# Altium schematic sheet Boost.SchDoc
size A; SheetNumber: 5; SheetTotal: 17
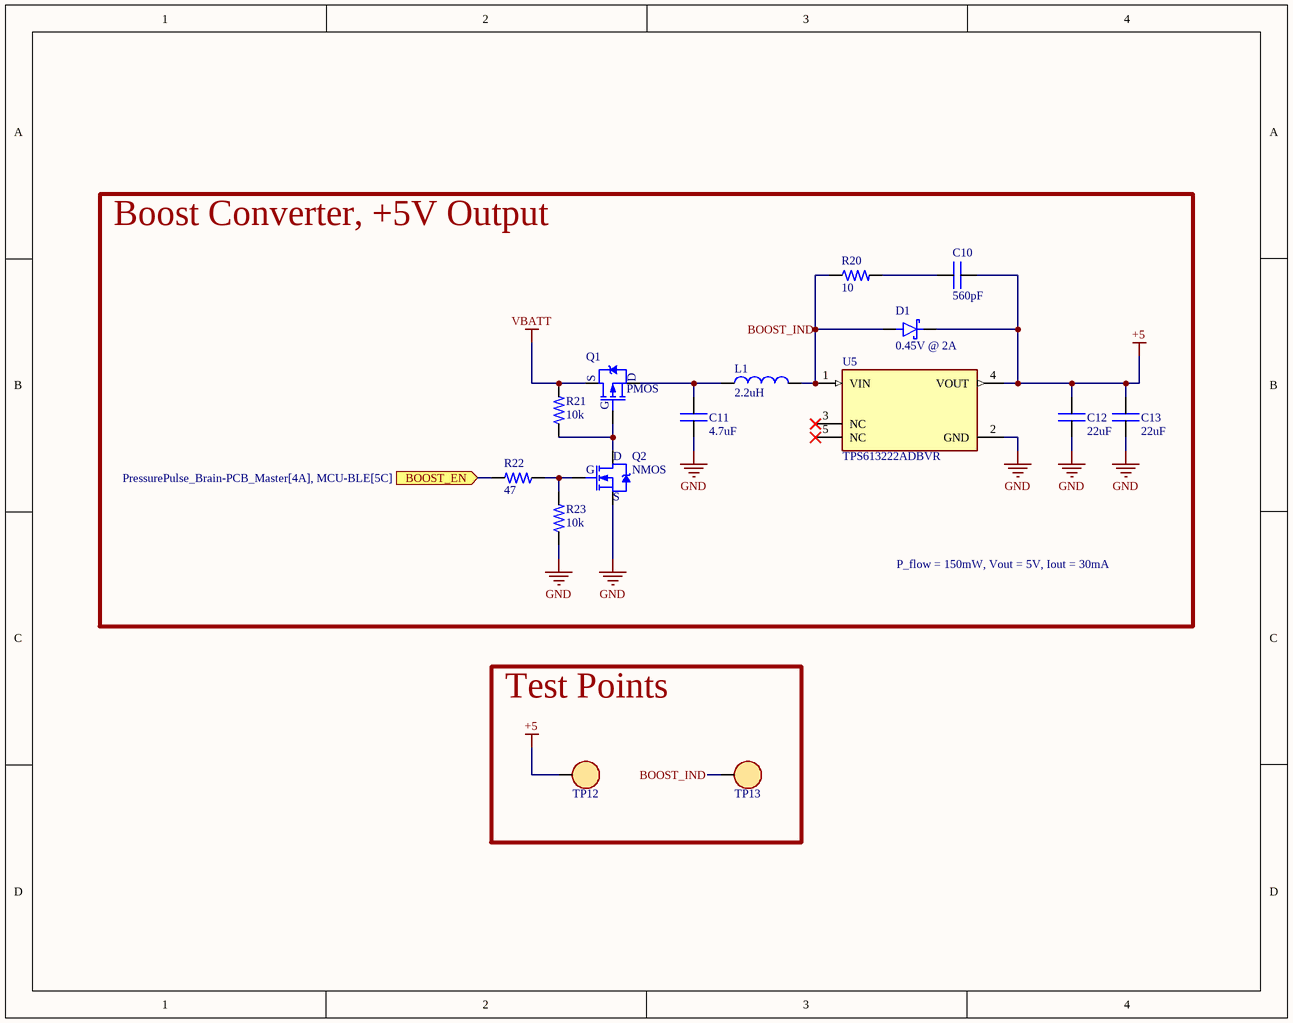
[diagram p0: Boost.SchDoc]

## Parts
C10  value 560pF  [0805C]  (hidden comment: CAP)
C11  value 4.7uF  [0402C]  (hidden comment: CAP)
C12  value 22uF  [0805C]  (hidden comment: CAP)
C13  value 22uF  [0805C]  (hidden comment: CAP)
D1  0.45V @ 2A  [SMAF]
L1  value 2.2uH  [0805L]  (hidden comment: IND)
Q1  PMOS  [SOT-23]
Q2  NMOS  [SOT-23]
R20  value 10  [2512R]  (hidden comment: RES)
R21  value 10k  [0402R]  (hidden comment: RES)
R22  value 47  [0402R]  (hidden comment: RES)
R23  value 10k  [0402R]  (hidden comment: RES)
TP12  RH-5019  [TP - RH-5019]  (value not drawn)
TP13  RH-5019  [TP - RH-5019]  (value not drawn)
U5  TPS613222ADBVR  [SOT-23-5]

## Blocks framed on the sheet
Boost Converter, +5V Output: C10-C13 D1 L1 Q1 Q2 R20-R23 U5
Test Points: TP12 TP13

## Ports
BOOST_EN (in, see PressurePulse_Brain-PCB_Master[4A], MCU-BLE[5C])

## Nets
+5: C10.2 C12.2 C13.2 D1.K TP12.1 U5.4(VOUT)
GND: C11.1 C12.1 C13.1 Q2.S R23.1 U5.2(GND)
VBATT: Q1.S R21.2
BOOST_EN: R22.2 ; port BOOST_EN
BOOST_IND: D1.A L1.2 R20.1 TP13.1 U5.1(VIN)
NetC10_1: C10.1 R20.2
NetC11_2: C11.2 L1.1 Q1.D
NetQ1_G: Q1.G Q2.D R21.1
NetQ2_G: Q2.G R22.1 R23.2

Not connected (* = marked no-connect by the designer): U5 3(NC)* 5(NC)*

## Notes on the sheet
- P_flow = 150mW, Vout = 5V, Iout = 30mA

## Library data of the parts
C10 C11 = CAP: Capacitor; Footprint: *
  C10: MFR: *; MFR PN: *; JLCPCB PN: C5186812
C12 C13 = CAP: Capacitor; MFR: Samsung Electro-Mechanics; MFR PN: CL21A226MAQNNNE; JLCPCB PN: C45783; Footprint: *
D1 = SCHOTTKY DIODE: MFR: Shandong Jingdao Microelectronics; MFR PN: SSL24F; Value: SSL24F; JLCPCB PN: C4749014
L1 = IND: INDUCTOR; MFR: Sunlord; MFR PN: WPN201610U2R2MT; JLCPCB PN: C71386; Footprint: *
Q1 = PMOS: P-Channel MOSFET; MFR: Diodes Incorporated; Value: PPMT12V4; Footprint: *; JLCPCB PN: C110724
Q2 = NMOS: 100V 1.6A 1.3W 220mΩ@10V,1.6A N Channel SOT-23  MOSFETs ROHS; MFR: Infineon; Value: IRLML0100TRPBF; MFR PN: IRLML0100TRPBF; JLCPCB PN: C53658
R20-R23 = RES: Resistor; MFR PN: *; MFR: *
  R20: JLCPCB PN: C3013385
  R21 R23: JLCPCB PN: C843837
  R22: JLCPCB PN: *
TP12 TP13 = TEST POINT: MFR: ronghe; MFR PN: RH-5019; Value: RH-5019; JLCPCB PN: C5199800
U5 = BOOST 3.3V-5V FIXED: 6-uA Quiescent Current, 1.8-A Switch Current Boost Converter 5-SOT-23 -40 to 85; MFR: Texas Instruments; MFR PN: TPS613222ADBVR; Value: TPS613222ADBVR; JLCPCB PN: C2071163